# EAGLE design eeZeeVGA (EAGLE 6.4)
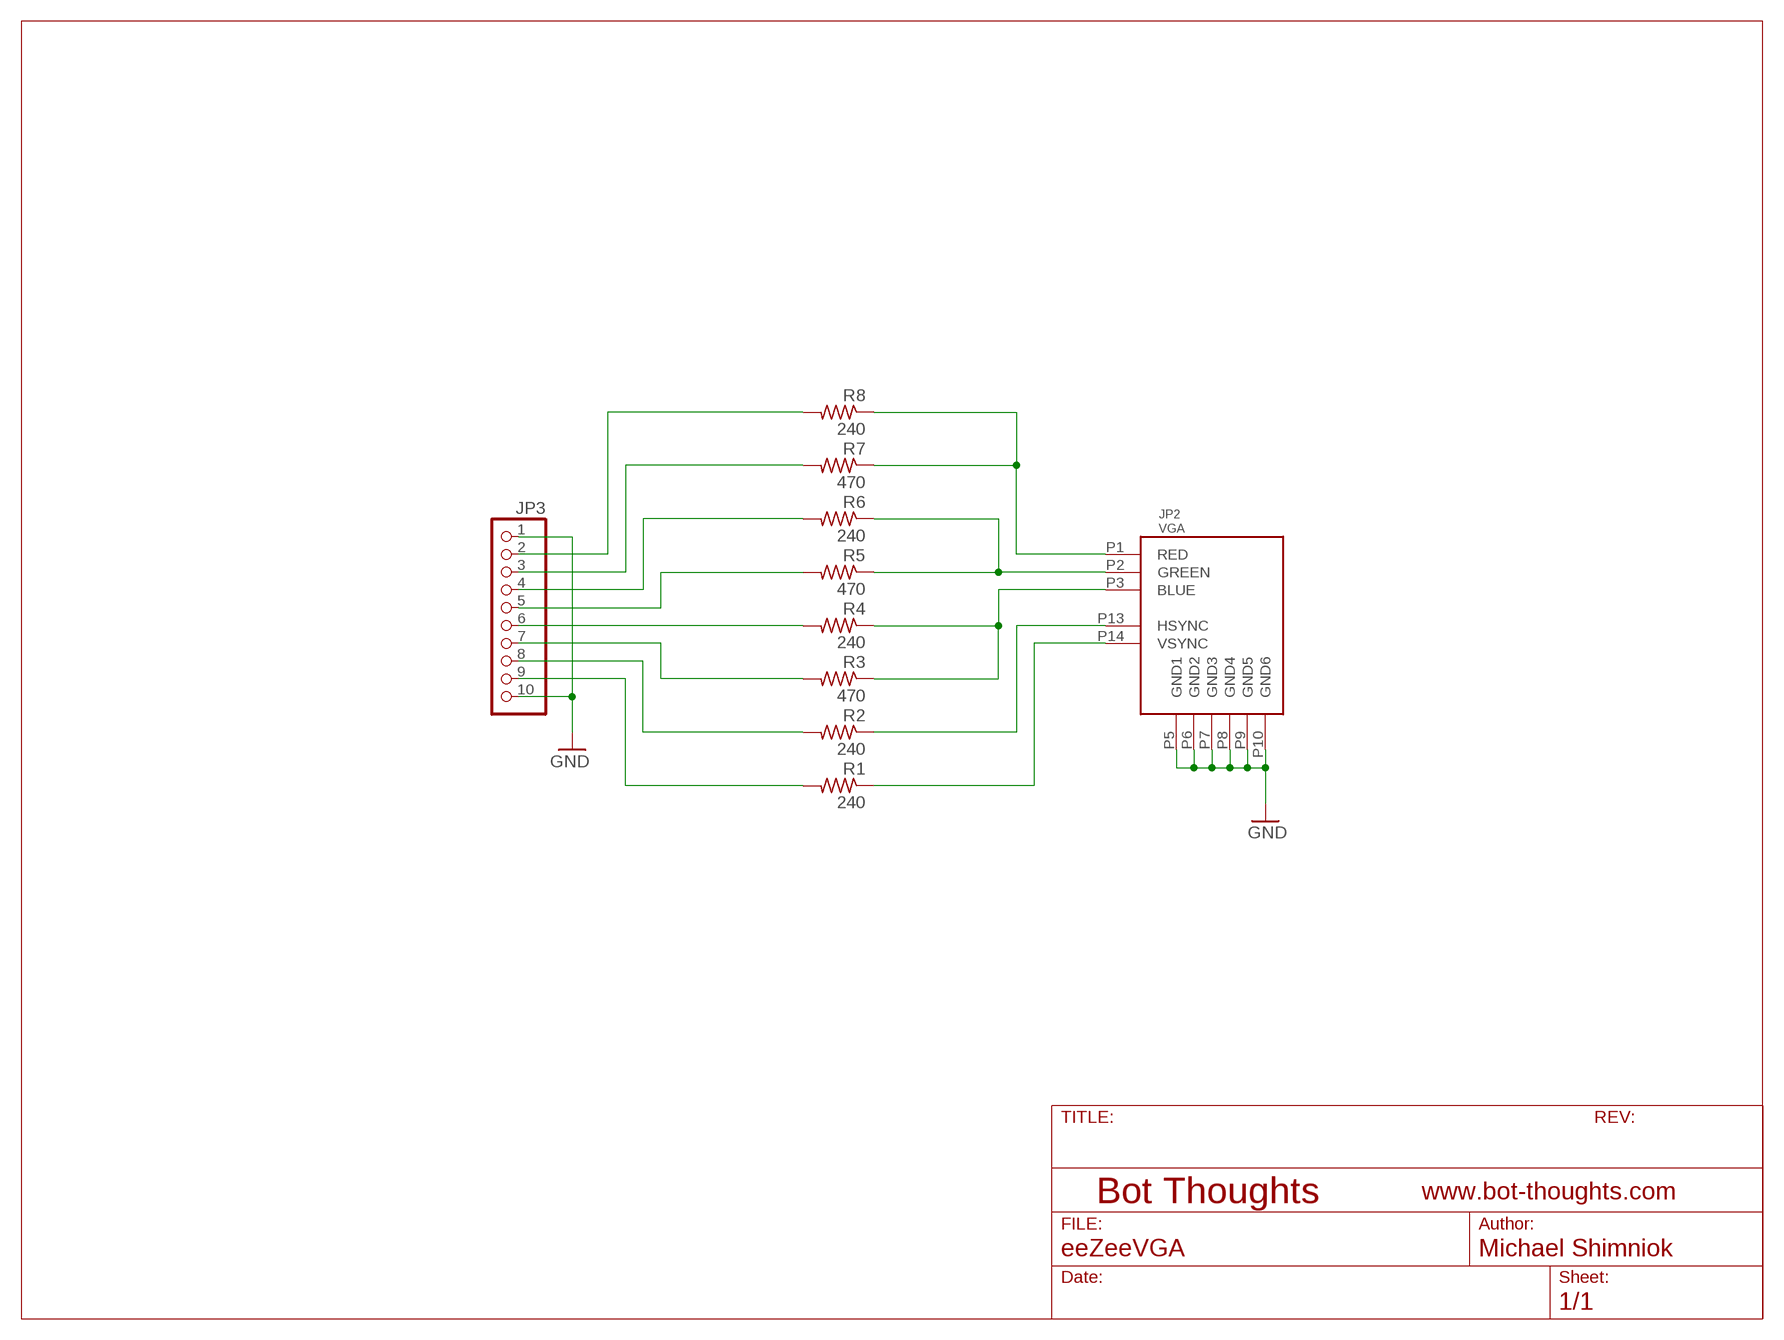
[diagram p0: schematic, sheet 1]

## Parts
JP2  VGA  [FCI_DSUB_HD_15_RA]
JP3  PINHD-1X10_2.54-S  [1X10-S]
R1  240  R-US_R0603  [R0603]
R2  240  R-US_R0603  [R0603]
R3  470  R-US_R0603  [R0603]
R4  240  R-US_R0603  [R0603]
R5  470  R-US_R0603  [R0603]
R6  240  R-US_R0603  [R0603]
R7  470  R-US_R0603  [R0603]
R8  240  R-US_R0603  [R0603]

## Nets
B: JP2.P3(BLUE) R3.1 R4.1
G: JP2.P2(GREEN) R5.1 R6.1
GND: JP2.P5(GND1) JP2.P6(GND2) JP2.P7(GND3) JP2.P8(GND4) JP2.P9(GND5) JP2.P10(GND6) JP3.1 JP3.10
H: JP2.P13(HSYNC) R2.1
N$12: JP3.9 R1.2
N$13: JP3.8 R2.2
N$14: JP3.7 R3.2
N$15: JP3.6 R4.2
N$16: JP3.5 R5.2
N$17: JP3.4 R6.2
N$18: JP3.3 R7.2
N$19: JP3.2 R8.2
R: JP2.P1(RED) R7.1 R8.1
V: JP2.P14(VSYNC) R1.1

## Library data of the parts
JP2 = mes_electromech:VGA: VGA Connector
JP3 = pinhead-2:PINHD-1X10: PIN HEADER
R1-R8 = rcl:R-US_: RESISTOR, American symbol

## Board
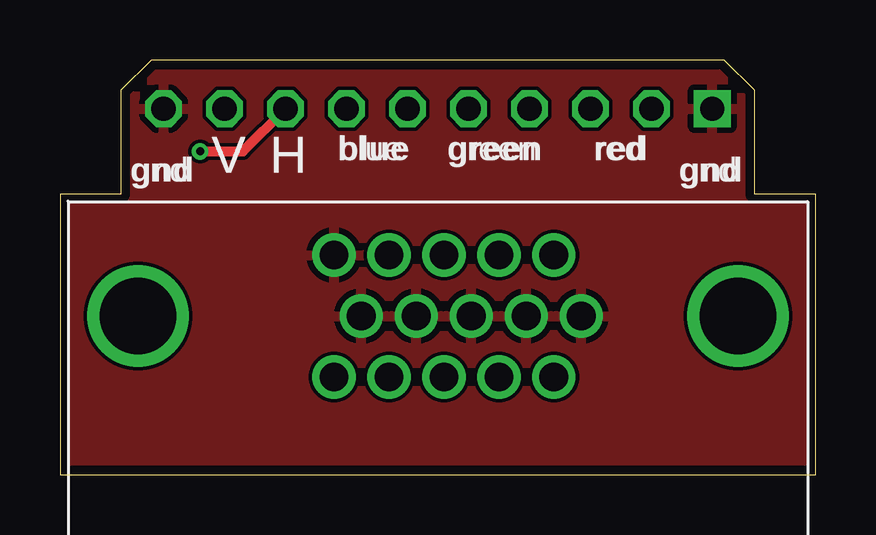
[diagram p1: board, top side]
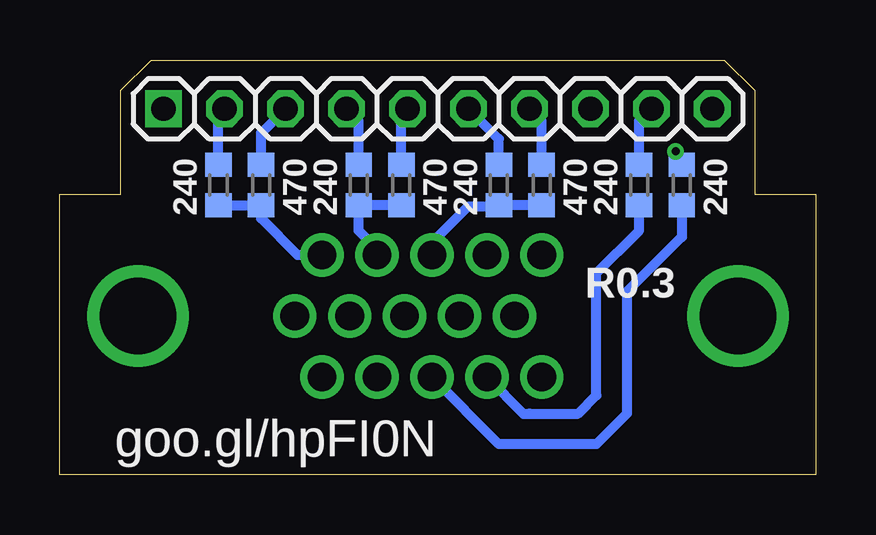
[diagram p2: board, bottom side, seen from below]

Size 31.5 x 17.27 mm. Coordinates in mm from the lower left corner, seen from the top.
Outline: 0,0 31.5,0 31.5,11.68 28.96,11.68 28.96,16 27.69,17.27 3.81,17.27 2.54,16 2.54,11.68 0,11.68 0,0
Copper layers (1*16): Top 0.0356mm / dielectric 1.5011mm / Bottom 0.0356mm
Design rules "LaenPCBOrder": minimum track width 6mil, minimum drill 13mil, track to track 6mil, track to pad 6mil, pad to pad 6mil, via to via 6mil, smd to smd 6mil, copper to edge 15mil, drill to drill 6mil, minimum pad ring 7mil, minimum via ring 7mil, stop-mask expansion 4mil, vias tented up to drill 0mil, thermal gap 10mil

### Footprints (pad centres in the part's own frame; a part is rotated, then mirrored left to right if it is on the bottom)
FCI_DSUB_HD_15_RA = drill 1.2: P1 4.83,2.54; P2 2.54,2.54; P3 0.25,2.54; P4 -2.04,2.54; P5 -4.33,2.54; P6 5.97,0; P7 3.68,0; P8 1.39,0; P9 -0.9,0; P10 -3.19,0; P11 4.83,-2.54; P12 2.54,-2.54; P13 0.25,-2.54; P14 -2.04,-2.54; P15 -4.33,-2.54 | drill 3.2: P$13 -12.5,0; P$14 12.5,0
1X10-S = drill 1.016 square: 1 -11.43,0 | drill 1.016 octagon: 2 -8.89,0; 3 -6.35,0; 4 -3.81,0; 5 -1.27,0; 6 1.27,0; 7 3.81,0; 8 6.35,0; 9 8.89,0; 10 11.43,0
R0603 = smd 1 x 1.1: 1 -0.85,0; 2 0.85,0

### Placement (x,y rotation side)
JP2  15.75,6.6 0 top
JP3  15.75,15.24 0 bottom
R1  7.37,12.06 90 bottom
R2  5.59,12.06 90 bottom
R3  11.43,12.06 90 bottom
R4  13.21,12.06 90 bottom
R5  17.27,12.06 90 bottom
R6  19.05,12.06 90 bottom
R7  23.11,12.06 90 bottom
R8  24.89,12.06 90 bottom

### Tracks (layer width: path | path; a pad name or v marks a point on that pad's centre or on a via)
B
  Bottom 0.406: R3.1 R4.1 13.25,11.18 14.48,11.18 16,9.66 JP2.P3
G
  Bottom 0.406: R5.1 R6.1 19.05,10.16 18.29,9.4 JP2.P2
GND
  pour Top: 0,0 31.5,0 31.5,11.68 28.96,11.68 28.96,16 27.69,17.27 3.81,17.27 2.54,16 2.54,11.68 0,11.68
H
  Bottom 0.406: R2.1 5.59,9.91 7.87,7.62 7.87,2.54 9.14,1.27 13.21,1.27 JP2.P13
N$12
  Bottom 0.406: R1.2 7.37,14.73 JP3.9
N$13  (via drill 0.33)
  Top 0.406: v5.84,13.46 7.62,13.46 JP3.8
  Bottom 0.406: R2.2 5.59,13.21 v5.84,13.46
N$14
  Bottom 0.406: R3.2 11.43,14.73 JP3.7
N$15
  Bottom 0.406: R4.2 13.21,13.97 JP3.6
N$16
  Bottom 0.406: R5.2 17.27,14.99 JP3.5
N$17
  Bottom 0.406: R6.2 19.05,14.73 JP3.4
N$18
  Bottom 0.406: R7.2 23.11,14.22 JP3.3
N$19
  Bottom 0.406: R8.2 24.89,14.99 JP3.2
R
  Bottom 0.406: R8.1 R7.1 23.11,10.67 21.59,9.14 JP2.P1
V
  Bottom 0.406: JP2.P14 12.18,2.53 11.94,2.54 9.91,2.54 9.14,3.3 9.14,8.38 7.37,10.16 R1.1

### Text on the board
tNames: V | H | blue | green | red | gnd | gnd
bNames: R0.3 | goo.gl/hpFI0N
tsilk: V | H | blue | green | red | gnd | gnd
bsilk: 240 | 240 | 470 | 240 | 470 | 240 | 470 | 240 | R0.3 | goo.gl/hpFI0N